# EAGLE design fsr_electrode_v2.0 (EAGLE 9.4.2)
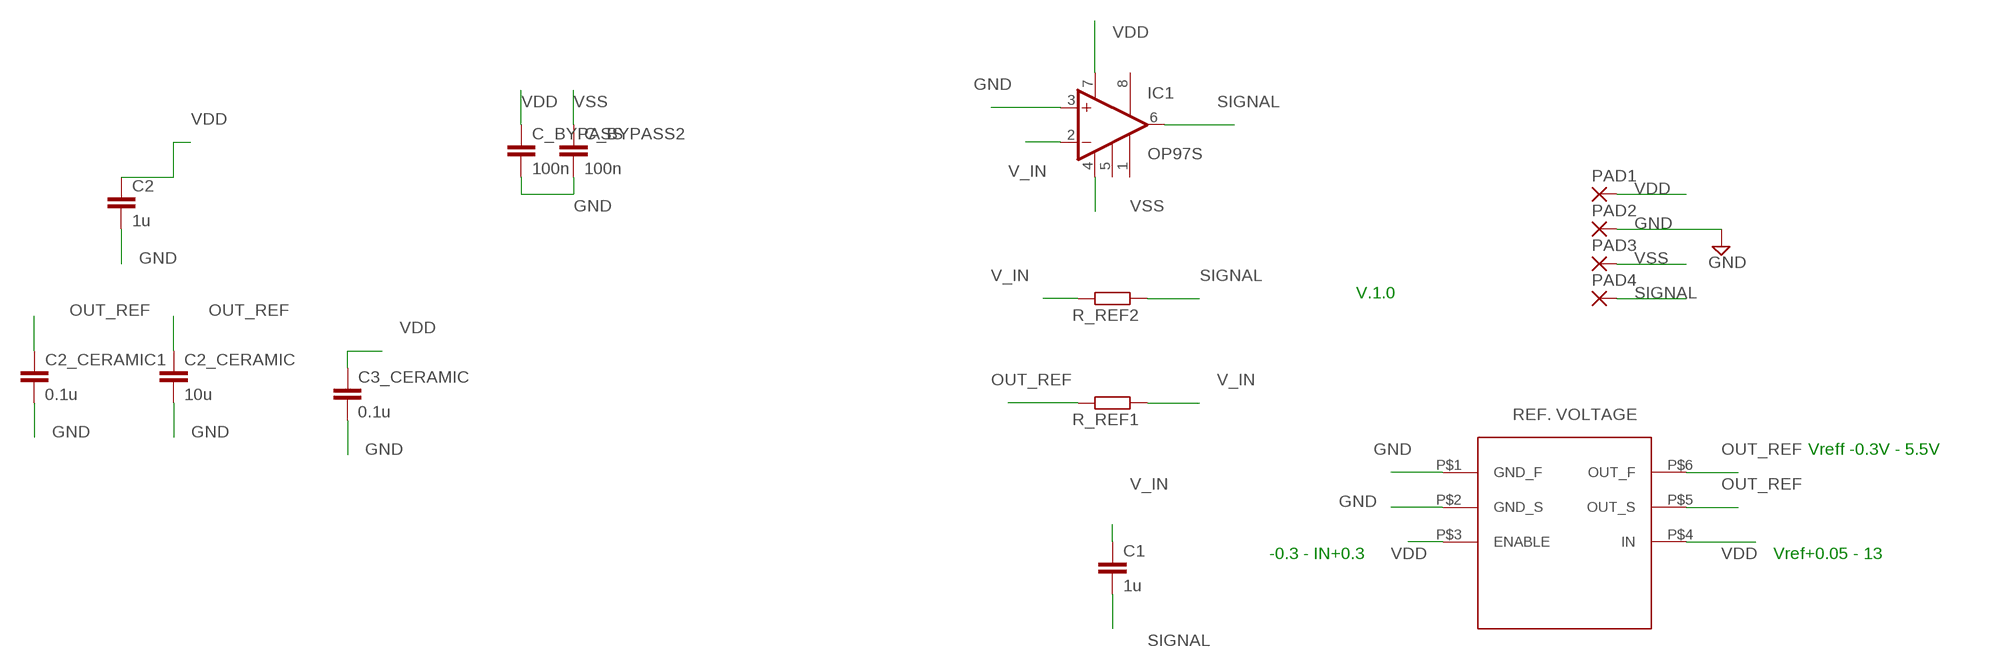
[diagram p0: schematic, sheet 1]

## Parts
C1  1u  C-EUC0805  [C0805]
C2  1u  C-EUC0805  [C0805]
C2_CERAMIC  10u  C-EUC0805  [C0805]
C2_CERAMIC1  0.1u  C-EUC0805  [C0805]
C3_CERAMIC  0.1u  C-EUC0805  [C0805]
C_BYPASS  100n  C-EUC0805  [C0805]
C_BYPASS2  100n  C-EUC0805  [C0805]
IC1  OP97S  [SO08]
PAD1  SMD5  [SMD2,54-5,08]
PAD2  SMD5  [SMD2,54-5,08]
PAD3  SMD5  [SMD2,54-5,08]
PAD4  SMD5  [SMD2,54-5,08]
R_REF1  10k  R-EU_M0805  [M0805]
R_REF2  10k  R-EU_M0805  [M0805]
REF3450  REF3450IDBVR  [UZUN]

## Nets
GND: C2.2 C2_CERAMIC1.2 C2_CERAMIC.2 C3_CERAMIC.2 C_BYPASS2.2 C_BYPASS.2 IC1.3(+IN) PAD2.1(P) REF3450.P$1(GND_F) REF3450.P$2(GND_S)
OUT_REF: C2_CERAMIC1.1 C2_CERAMIC.1 R_REF1.2 REF3450.P$5(OUT_S) REF3450.P$6(OUT_F)
SIGNAL: C1.2 IC1.6(OUT) PAD4.1(P) R_REF2.1
V_IN: C1.1 IC1.2(-IN) R_REF1.1 R_REF2.2
VDD: C2.1 C3_CERAMIC.1 C_BYPASS.1 IC1.7(V+) PAD1.1(P) REF3450.P$3(ENABLE) REF3450.P$4(IN)
VSS: C_BYPASS2.1 IC1.4(V-) PAD3.1(P)
Unconnected: IC1.1(BAL1) IC1.5(COMP) IC1.8(BAL2)

## Notes on the sheet
- V.1.0
- Vreff -0.3V - 5.5V
- -0.3 - IN+0.3 | Vref+0.05 - 13

## Library data of the parts
C1 C2 C2_CERAMIC C2_CERAMIC1 C3_CERAMIC = rcl:C-EU: CAPACITOR, European symbol; SPICEPREFIX: C
C_BYPASS C_BYPASS2 = resistor:C-EU: CAPACITOR, European symbol
IC1 = linear:OP97: Low Power, High Precision Operational Amplifier Source: http://www.analog.com/static/imported-files/data_sheets/OP97.pdf
PAD1-PAD4 = wirepad:SMD5: SMD PAD
R_REF1 R_REF2 = rcl:R-EU_: RESISTOR, European symbol; SPICEPREFIX: R
REF3450 = Spannungsreferenzen:REF3450IDBVR

## Board
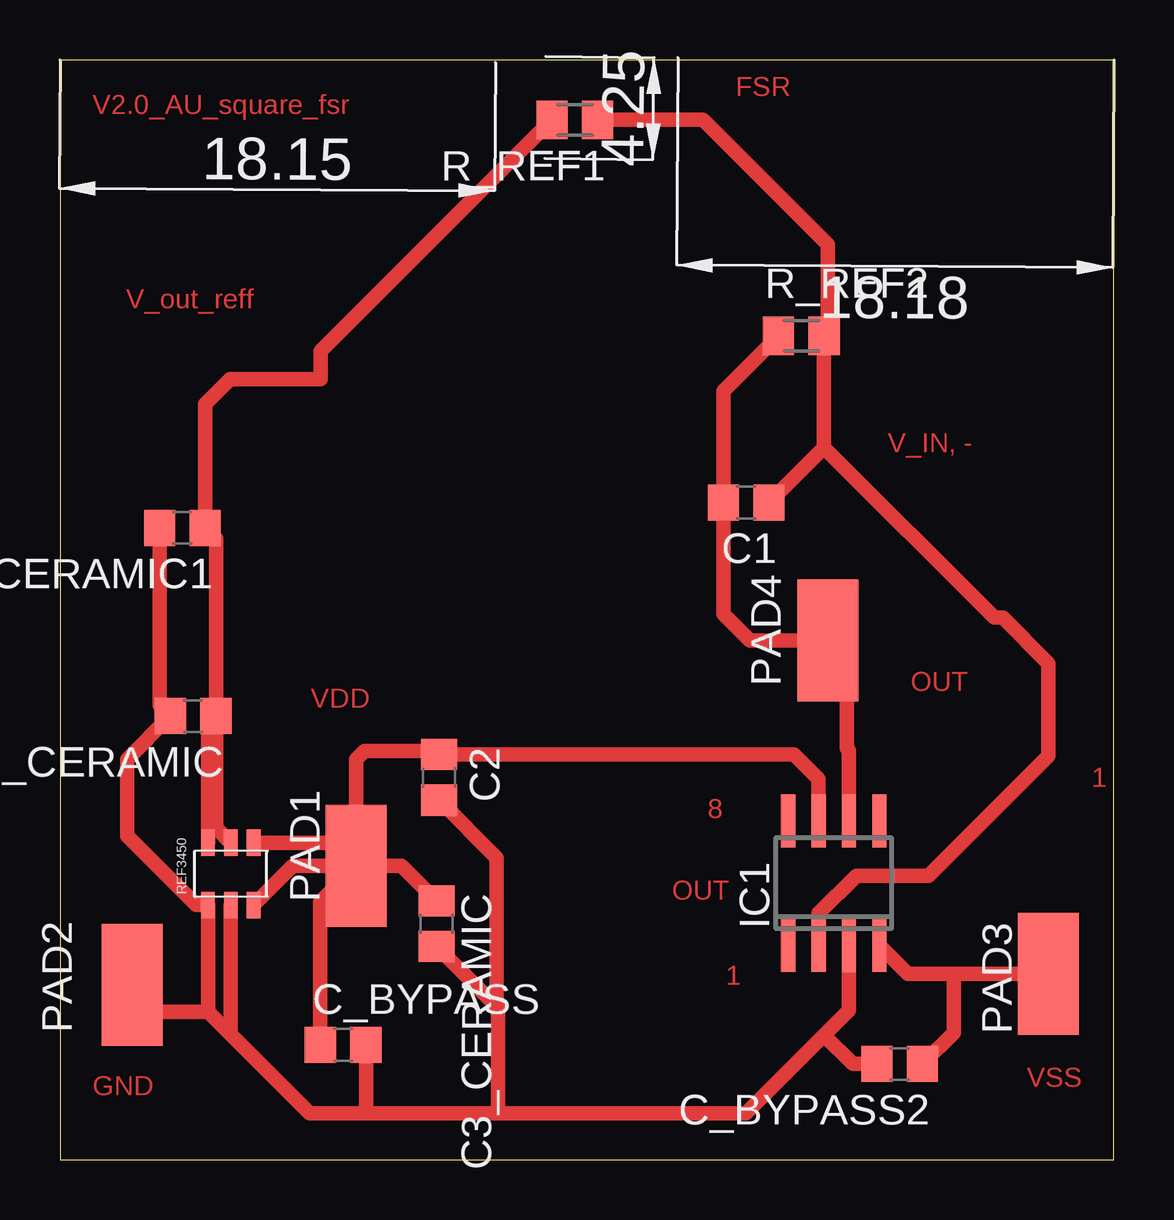
[diagram p1: board, top side]

Size 43.93 x 45.85 mm. Coordinates in mm from the lower left corner, seen from the top.
Outline: 0,0 43.93,0 43.93,45.85 0,45.85 0,0
Copper layers (1*16): Top 0.035mm / dielectric 1.5mm / Bottom 0.035mm
Design rules "TM_medit_aetzen": minimum track width 10mil, minimum drill 8mil, track to track 10mil, track to pad 10mil, pad to pad 10mil, via to via 15mil, smd to smd 8mil, copper to edge 40mil, drill to drill 8mil, minimum pad ring 10mil, minimum via ring 8mil, stop-mask expansion 4mil, vias tented up to drill 0mil, thermal gap 10mil

### Footprints (pad centres in the part's own frame; a part is rotated, then mirrored left to right if it is on the bottom)
C0805 = smd 1.3 x 1.5: 1 -0.95,0; 2 0.95,0
SO08 = smd 0.6 x 2.2: 1 -1.905,-2.6; 2 -0.635,-2.6; 3 0.635,-2.6; 4 1.905,-2.6; 5 1.905,2.6; 6 0.635,2.6; 7 -0.635,2.6; 8 -1.905,2.6
SMD2,54-5,08 = smd 2.54 x 5.08: 1 0,0
M0805 = smd 1.3 x 1.6: 1 -0.95,0; 2 0.95,0
UZUN = smd 1.1 x 0.6: P$1 0,0; P$2 0,-0.95; P$3 0,-1.9; P$4 2.6,-1.9; P$5 2.6,-0.95; P$6 2.6,0

### Placement (x,y rotation side)
C1  28.6,27.4 180 top
C2  15.8,15.95 270 top
C2_CERAMIC  5.55,18.5 180 top
C2_CERAMIC1  5.1,26.35 180 top
C3_CERAMIC  15.7,9.85 270 top
C_BYPASS  11.8,4.8 0 top
C_BYPASS2  35,4 180 top
IC1  32.25,11.53 0 top
PAD1  12.34,12.25 0 top
PAD2  3.01,7.3 0 top
PAD3  41.19,7.75 0 top
PAD4  32.01,21.65 0 top
R_REF1  21.46,43.35 180 top
R_REF2  30.9,34.35 0 top
REF3450  6.17,10.62 90 top

### Tracks (layer width: path | path; a pad name or v marks a point on that pad's centre or on a via)
GND
  Top 0.61: 12.7,1.95 10.4,1.95 7,5.35 | 12.7,1.95 18.25,1.95 | 18.25,1.95 28.6,1.95 31.85,5.2 | 6.17,6.18 7,5.35 | REF3450.P$2 7.12,5.47 7,5.35 | C2_CERAMIC1.2 4.15,18.95 C2_CERAMIC.2 2.8,16.7 2.8,13.5 5.67,10.62 REF3450.P$1 6.17,6.18 | C3_CERAMIC.2 17.95,6.65 | 17.95,6.65 18.2,6.65 18.2,12.6 C2.2 | 17.95,6.65 18.25,6.35 18.25,1.95 | 6.17,6.18 4.14,6.18 PAD2.1 | 31.85,5.2 32.89,6.24 IC1.3 | C_BYPASS2.2 33.05,4 31.85,5.2 | C_BYPASS.2 12.75,2 12.7,1.95
OUT_REF
  Top 0.61: R_REF1.2 10.87,33.72 10.87,32.55 7.1,32.55 6.05,31.5 C2_CERAMIC1.1 6.5,25.9 C2_CERAMIC.1 6.5,18.4 | 6.5,18.4 6.5,13.85 REF3450.P$5 | REF3450.P$6 6.17,18.07 6.5,18.4
SIGNAL
  Top 0.61: R_REF2.1 27.65,32.05 C1.2 27.65,22.77 28.76,21.66 PAD4.1 32.8,20.87 32.8,17.15 32.89,17.06 IC1.6
V_IN
  Top 0.61: R_REF1.1 26.8,43.35 32,38.15 32,34.5 R_REF2.2 31.85,29.7 | C1.1 31.85,29.7 | IC1.2 31.62,10.27 33.2,11.85 36.2,11.85 41.2,16.85 41.2,20.7 39.3,22.6 38.95,22.6 31.85,29.7
VDD
  Top 0.61: IC1.7 31.62,15.88 30.6,16.9 C2.1 15.65,17.05 12.7,17.05 12.34,16.69 PAD1.1 | PAD1.1 11.37,13.22 REF3450.P$4 | PAD1.1 9.7,12.26 REF3450.P$3 | PAD1.1 14.24,12.26 C3_CERAMIC.1 | C_BYPASS.1 10.85,10.76 PAD1.1
VSS
  Top 0.61: PAD3.1 37.25,7.75 | 37.25,7.75 35.34,7.75 IC1.4 | C_BYPASS2.1 37.25,5.3 37.25,7.75

### Text on the board
Top: V2.0_AU_square_fsr | FSR | V_out_reff | V_IN, - | OUT | VDD | 1 | 8 | OUT | 1 | GND | VSS